# EAGLE design Relay_Board_2nd_Iteration (EAGLE 9.6.2)
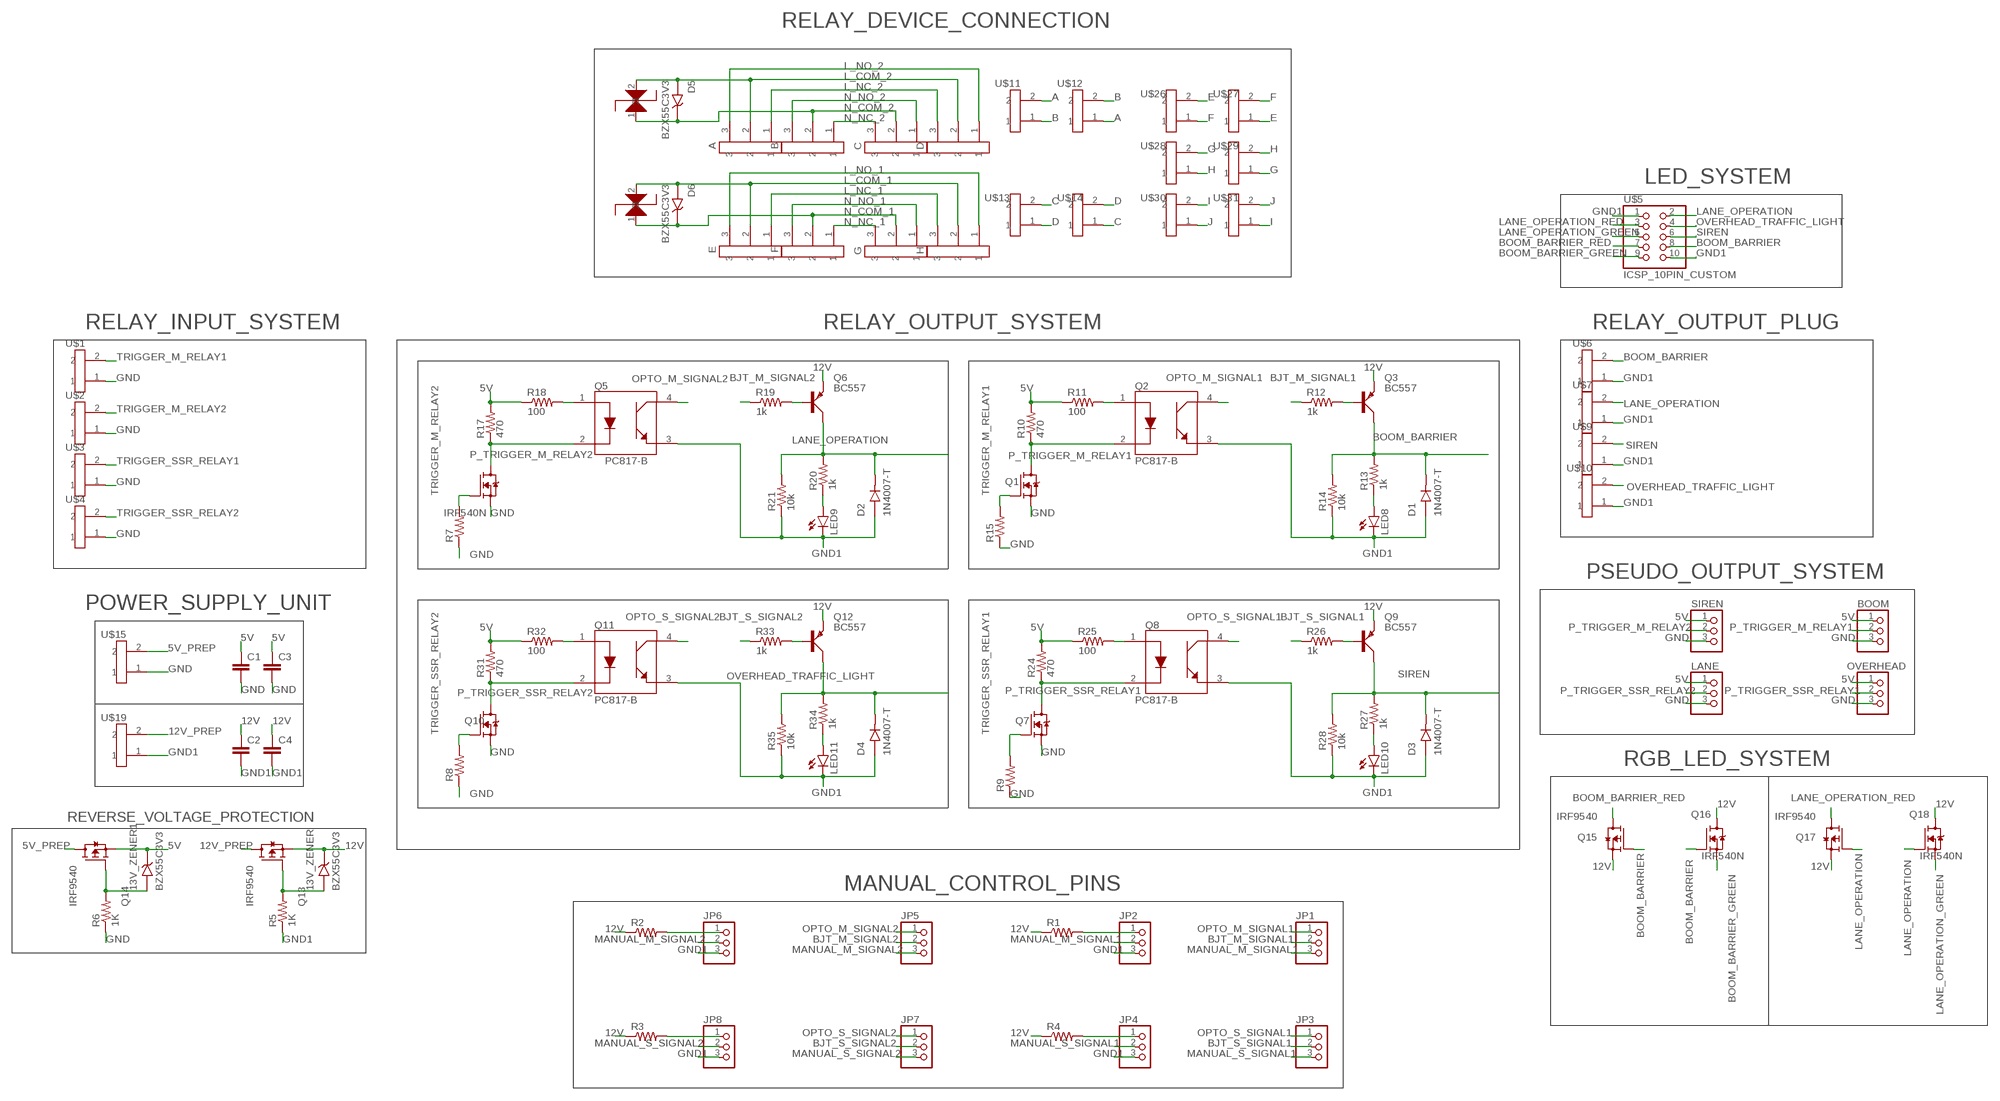
[diagram p0: schematic, sheet 1]

## Parts
13V_ZENER  BZX55C3V3  [DIOAD928W47L399D179]
13V_ZENER1  BZX55C3V3  [DIOAD928W47L399D179]
A  GREEN_PLUG_3  [GREEN_PLUG_3]
B  GREEN_PLUG_3  [GREEN_PLUG_3]
BOOM  PINHD-1X3  [1X03]
C  GREEN_PLUG_90_3  [GREEN_PLUG_90_3]
C1  CAPACITOR  [CAPACITOR]
C2  CAPACITOR  [CAPACITOR]
C3  CAPACITOR  [CAPACITOR]
C4  CAPACITOR  [CAPACITOR]
D  GREEN_PLUG_90_3  [GREEN_PLUG_90_3]
D1  1N4007-T  [DIOAD780W78L463D236]
D2  1N4007-T  [DIOAD780W78L463D236]
D3  1N4007-T  [DIOAD780W78L463D236]
D4  1N4007-T  [DIOAD780W78L463D236]
D5  BZX55C3V3  [DIOAD928W47L399D179]
D6  BZX55C3V3  [DIOAD928W47L399D179]
E  GREEN_PLUG_3  [GREEN_PLUG_3]
F  GREEN_PLUG_3  [GREEN_PLUG_3]
G  GREEN_PLUG_90_3  [GREEN_PLUG_90_3]
H  GREEN_PLUG_90_3  [GREEN_PLUG_90_3]
JP1  PINHD-1X3  [1X03]
JP2  PINHD-1X3  [1X03]
JP3  PINHD-1X3  [1X03]
JP4  PINHD-1X3  [1X03]
JP5  PINHD-1X3  [1X03]
JP6  PINHD-1X3  [1X03]
JP7  PINHD-1X3  [1X03]
JP8  PINHD-1X3  [1X03]
LANE  PINHD-1X3  [1X03]
LED8  LED  [LED]
LED9  LED  [LED]
LED10  LED  [LED]
LED11  LED  [LED]
OVERHEAD  PINHD-1X3  [1X03]
Q1  IRF540N  [TO254P1054X469X1930-3]
Q2  PC817-B  [DIP762W50P254L650H455Q4B]
Q3  BC557  [SOT54A]
Q4  IRF540N  [TO254P1054X469X1930-3]
Q5  PC817-B  [DIP762W50P254L650H455Q4B]
Q6  BC557  [SOT54A]
Q7  IRF540N  [TO254P1054X469X1930-3]
Q8  PC817-B  [DIP762W50P254L650H455Q4B]
Q9  BC557  [SOT54A]
Q10  IRF540N  [TO254P1054X469X1930-3]
Q11  PC817-B  [DIP762W50P254L650H455Q4B]
Q12  BC557  [SOT54A]
Q13  IRF9540  [TO254P1052X465X1989-3]
Q14  IRF9540  [TO254P1052X465X1989-3]
Q15  IRF9540  [TO254P1052X465X1989-3]
Q16  IRF540N  [TO254P1054X469X1930-3]
Q17  IRF9540  [TO254P1052X465X1989-3]
Q18  IRF540N  [TO254P1054X469X1930-3]
R1  RESISTOR  [RESISTOR]
R2  RESISTOR  [RESISTOR]
R3  RESISTOR  [RESISTOR]
R4  RESISTOR  [RESISTOR]
R5  1K  RESISTOR  [RESISTOR]
R6  1K  RESISTOR  [RESISTOR]
R7  RESISTOR  [RESISTOR]
R8  RESISTOR  [RESISTOR]
R9  RESISTOR  [RESISTOR]
R10  470  RESISTOR  [RESISTOR]
R11  100  RESISTOR  [RESISTOR]
R12  1k  RESISTOR  [RESISTOR]
R13  1k  RESISTOR  [RESISTOR]
R14  10k  RESISTOR  [RESISTOR]
R15  RESISTOR  [RESISTOR]
R17  470  RESISTOR  [RESISTOR]
R18  100  RESISTOR  [RESISTOR]
R19  1k  RESISTOR  [RESISTOR]
R20  1k  RESISTOR  [RESISTOR]
R21  10k  RESISTOR  [RESISTOR]
R24  470  RESISTOR  [RESISTOR]
R25  100  RESISTOR  [RESISTOR]
R26  1k  RESISTOR  [RESISTOR]
R27  1k  RESISTOR  [RESISTOR]
R28  10k  RESISTOR  [RESISTOR]
R31  470  RESISTOR  [RESISTOR]
R32  100  RESISTOR  [RESISTOR]
R33  1k  RESISTOR  [RESISTOR]
R34  1k  RESISTOR  [RESISTOR]
R35  10k  RESISTOR  [RESISTOR]
SIREN  PINHD-1X3  [1X03]
U$1  GREEN_PLUG_90_2  [GREEN_PLUG_90_2]
U$2  GREEN_PLUG_90_2  [GREEN_PLUG_90_2]
U$3  GREEN_PLUG_90_2  [GREEN_PLUG_90_2]
U$4  GREEN_PLUG_90_2  [GREEN_PLUG_90_2]
U$5  ICSP_10PIN_CUSTOM  [ICSP_10PIN_CUSTOM]
U$6  GREEN_PLUG_2  [GREEN_PLUG_2]
U$7  GREEN_PLUG_2  [GREEN_PLUG_2]
U$9  GREEN_PLUG_2  [GREEN_PLUG_2]
U$10  GREEN_PLUG_2  [GREEN_PLUG_2]
U$11  GREEN_PLUG_2  [GREEN_PLUG_2]
U$12  GREEN_PLUG_90_2  [GREEN_PLUG_90_2]
U$13  GREEN_PLUG_90_2  [GREEN_PLUG_90_2]
U$14  GREEN_PLUG_2  [GREEN_PLUG_2]
U$15  GREEN_PLUG_90_2  [GREEN_PLUG_90_2]
U$19  GREEN_PLUG_90_2  [GREEN_PLUG_90_2]
U$24  1KE100A_CUSTOM  [1KE100A_CUSTOM]
U$25  1KE100A_CUSTOM  [1KE100A_CUSTOM]
U$26  GREEN_PLUG_2  [GREEN_PLUG_2]
U$27  GREEN_PLUG_90_2  [GREEN_PLUG_90_2]
U$28  GREEN_PLUG_2  [GREEN_PLUG_2]
U$29  GREEN_PLUG_90_2  [GREEN_PLUG_90_2]
U$30  GREEN_PLUG_2  [GREEN_PLUG_2]
U$31  GREEN_PLUG_90_2  [GREEN_PLUG_90_2]

## Nets
5V: 13V_ZENER1.C(K) BOOM.1 C1.1 C3.1 LANE.1 OVERHEAD.1 Q14.3(S) R10.2 R11.1 R17.2 R18.1 R24.2 R25.1 R31.2 R32.1 SIREN.1
5V_PREP: Q14.2(D) U$15.2
12V: 13V_ZENER.C(K) C2.1 C4.1 Q3.E Q6.E Q9.E Q12.E Q13.3(S) Q15.3(S) Q16.2(D) Q17.3(S) Q18.2(D) R1.1 R2.1 R3.1 R4.1
12V_PREP: Q13.2(D) U$19.2
A: U$11.2 U$12.1
B: U$11.1 U$12.2
BJT_M_SIGNAL1: JP1.2 R12.1
BJT_M_SIGNAL2: JP5.2 R19.1
BJT_S_SIGNAL1: JP3.2 R26.1
BJT_S_SIGNAL2: JP7.2 R33.1
BOOM_BARRIER: D1.K Q3.C Q15.1(G) Q16.1(G) R13.2 R14.2 U$5.8 U$6.2
BOOM_BARRIER_GREEN: Q16.3(S) U$5.9
BOOM_BARRIER_RED: Q15.2(D) U$5.7
C: U$13.2 U$14.1
D: U$13.1 U$14.2
E: U$26.2 U$27.1
F: U$26.1 U$27.2
G: U$28.2 U$29.1
GND: BOOM.3 C1.2 C3.2 LANE.3 OVERHEAD.3 Q1.3(S) Q4.3(S) Q7.3(S) Q10.3(S) R6.1 R7.1 R8.1 R9.1 R15.1 SIREN.3 U$1.1 U$2.1 U$3.1 U$4.1 U$15.1
GND1: C2.2 C4.2 D1.A D2.A D3.A D4.A JP2.3 JP4.3 JP6.3 JP8.3 LED8.K(C) LED9.K(C) LED10.K(C) LED11.K(C) Q2.3(EMITTER) Q5.3(EMITTER) Q8.3(EMITTER) Q11.3(EMITTER) R5.1 R14.1 R21.1 R28.1 R35.1 U$5.1 U$5.10 U$6.1 U$7.1 U$9.1 U$10.1 U$19.1
H: U$28.1 U$29.2
I: U$30.2 U$31.1
J: U$30.1 U$31.2
L_COM_1: D6.A E.2 H.2 U$25.2
L_COM_2: A.2 D5.A D.2 U$24.2
L_NC_1: E.1 H.3
L_NC_2: A.1 D.3
L_NO_1: E.3 H.1
L_NO_2: A.3 D.1
LANE_OPERATION: D2.K Q6.C Q17.1(G) Q18.1(G) R20.2 R21.2 U$5.2 U$7.2
LANE_OPERATION_GREEN: Q18.3(S) U$5.5
LANE_OPERATION_RED: Q17.2(D) U$5.3
MANUAL_M_SIGNAL1: JP1.3 JP2.2
MANUAL_M_SIGNAL2: JP5.3 JP6.2
MANUAL_S_SIGNAL1: JP3.3 JP4.2
MANUAL_S_SIGNAL2: JP7.3 JP8.2
N$1: 13V_ZENER1.A Q14.1(G) R6.2
N$2: Q3.B R12.2
N$3: 13V_ZENER.A Q13.1(G) R5.2
N$8: JP2.1 R1.2
N$11: JP4.1 R4.2
N$12: LED8.A R13.1
N$14: Q2.1(ANODE) R11.2
N$16: Q6.B R19.2
N$18: LED9.A R20.1
N$19: Q5.1(ANODE) R18.2
N$23: Q9.B R26.2
N$25: LED10.A R27.1
N$26: Q8.1(ANODE) R25.2
N$28: JP6.1 R2.2
N$30: Q12.B R33.2
N$32: LED11.A R34.1
N$33: Q11.1(ANODE) R32.2
N$34: JP8.1 R3.2
N_COM_1: D6.C(K) F.2 G.2 U$25.1
N_COM_2: B.2 C.2 D5.C(K) U$24.1
N_NC_1: F.1 G.3
N_NC_2: B.1 C.3
N_NO_1: F.3 G.1
N_NO_2: B.3 C.1
OPTO_M_SIGNAL1: JP1.1 Q2.4(COLLECTOR)
OPTO_M_SIGNAL2: JP5.1 Q5.4(COLLECTOR)
OPTO_S_SIGNAL1: JP3.1 Q8.4(COLLECTOR)
OPTO_S_SIGNAL2: JP7.1 Q11.4(COLLECTOR)
OVERHEAD_TRAFFIC_LIGHT: D4.K Q12.C R34.2 R35.2 U$5.4 U$10.2
P_TRIGGER_M_RELAY1: BOOM.2 Q1.2(D) Q2.2(CATHODE) R10.1
P_TRIGGER_M_RELAY2: Q4.2(D) Q5.2(CATHODE) R17.1 SIREN.2
P_TRIGGER_SSR_RELAY1: OVERHEAD.2 Q7.2(D) Q8.2(CATHODE) R24.1
P_TRIGGER_SSR_RELAY2: LANE.2 Q10.2(D) Q11.2(CATHODE) R31.1
SIREN: D3.K Q9.C R27.2 R28.2 U$5.6 U$9.2
TRIGGER_M_RELAY1: Q1.1(G) R15.2 U$1.2
TRIGGER_M_RELAY2: Q4.1(G) R7.2 U$2.2
TRIGGER_SSR_RELAY1: Q7.1(G) R9.2 U$3.2
TRIGGER_SSR_RELAY2: Q10.1(G) R8.2 U$4.2

## Notes on the sheet
- RELAY_DEVICE_CONNECTION
- LED_SYSTEM
- RELAY_INPUT_SYSTEM | RELAY_OUTPUT_SYSTEM | RELAY_OUTPUT_PLUG
- PSEUDO_OUTPUT_SYSTEM
- POWER_SUPPLY_UNIT
- RGB_LED_SYSTEM
- REVERSE_VOLTAGE_PROTECTION
- MANUAL_CONTROL_PINS

## Library data of the parts
13V_ZENER 13V_ZENER1 D5 D6 = BZX55C3V3:BZX55C3V3: Check availability <https://pricing.snapeda.com/parts/BZX55C3V3-TR/Vishay%20Semiconductor/view-part?ref=eda>; AVAILABILITY: In Stock; CHECK_PRICES: https://www.snapeda.com/parts/BZX55C3V3-TR/Vishay/view-part/?ref=eda; DESCRIPTION: Zener Diode 3.3 V 500 mW ±6% Through Hole DO-204AH (DO-35); MF: Vishay Semiconductor; MP: BZX55C3V3-TR; PACKAGE: DO-35 NXP Semiconductors; PRICE: None; SNAPEDA_LINK: https://www.snapeda.com/parts/BZX55C3V3-TR/Vishay/view-part/?ref=snap
A B E F = Green_plug_90:GREEN_PLUG_3
BOOM JP1-JP8 LANE OVERHEAD SIREN = pinhead:PINHD-1X3: PIN HEADER
C D G H = Green_plug_90:GREEN_PLUG_90_3
C1-C4 = Hand_Solder:CAPACITOR: Hand Solder Capacitor
D1-D4 = 1N4007-T:1N4007-T: Check availability <https://pricing.snapeda.com/parts/1N4007-T/Diodes%20Incorporated/view-part?ref=eda>; AVAILABILITY: In Stock; CHECK_PRICES: https://www.snapeda.com/parts/1N4007-T/Diodes+Inc./view-part/?ref=eda; DESCRIPTION: Diode Standard 1A 1000V 1Vf DO41 | Diodes Inc 1N4007-T; MF: Diodes Incorporated; MP: 1N4007-T; PACKAGE: DO-41 Diodes Inc.; PRICE: None; SNAPEDA_LINK: https://www.snapeda.com/parts/1N4007-T/Diodes+Inc./view-part/?ref=snap
LED8-LED11 = Hand_Solder:LED: LED HAND SOLDER
Q1 Q4 Q7 Q10 Q16 Q18 = IRF540N:IRF540N: Check availability <https://pricing.snapeda.com/parts/IRF540N/Infineon%20Technologies/view-part?ref=eda>; AVAILABILITY: In Stock; CHECK_PRICES: https://www.snapeda.com/parts/IRF540N/Infineon/view-part/?ref=eda; DESCRIPTION: Transistor NPN MOS IRF540/IRF540N INTERNATIONAL RECTIFIER Ampere=28 V=100 TO220; MF: Infineon Technologies; MP: IRF540N; PACKAGE: Package; PRICE: None; SNAPEDA_LINK: https://www.snapeda.com/parts/IRF540N/Infineon/view-part/?ref=snap
Q2 Q5 Q8 Q11 = PC817-B:PC817-B: Check availability <https://pricing.snapeda.com/parts/PC817-B/American%20Bright/view-part?ref=eda>; AVAILABILITY: Not in stock; CHECK_PRICES: https://www.snapeda.com/parts/PC817-B/American+Bright/view-part/?ref=eda; DESCRIPTION: Phototransistors 4-DIP (0.300, 7.62mm); MF: American Bright; MP: PC817-B; PACKAGE: DIP-4 American Bright; PRICE: None; SNAPEDA_LINK: https://www.snapeda.com/parts/PC817-B/American+Bright/view-part/?ref=snap
Q3 Q6 Q9 Q12 = BC557:BC557: Check availability <https://pricing.snapeda.com/parts/BC557/ON%20Semiconductor/view-part?ref=eda>; AVAILABILITY: Not in stock; CHECK_PRICES: https://www.snapeda.com/parts/BC557/Onsemi/view-part/?ref=eda; DESCRIPTION: Bipolar (BJT) Transistor PNP 45 V 100 mA 320MHz 625 mW Through Hole TO-92 (TO-226); MF: ON Semiconductor; MP: BC557; PACKAGE: E-PKG AXIAL-LEADED-2 ON Semiconductor; PRICE: None; SNAPEDA_LINK: https://www.snapeda.com/parts/BC557/Onsemi/view-part/?ref=snap
Q13-Q15 Q17 = IRF9540:IRF9540: Trans MOSFET P-CH 100V 6.8A 3-Pin(3+Tab) TO-220AB Check availability <https://pricing.snapeda.com/parts/IRF9540/Vishay%20Siliconix/view-part?ref=eda>; AVAILABILITY: In Stock; CHECK_PRICES: https://www.snapeda.com/parts/IRF9540/Vishay/view-part/?ref=eda; DESCRIPTION: P-Channel 100 V 19A (Tc) 3.7W (Ta), 150W (Tc) Surface Mount D²PAK (TO-263); MF: Vishay Siliconix; MP: IRF9540; PACKAGE: TO-220-3 Vishay; PRICE: None; SNAPEDA_LINK: https://www.snapeda.com/parts/IRF9540/Vishay/view-part/?ref=snap
R1-R15 R17-R21 R24-R28 R31-R35 = Hand_Solder:RESISTOR: Hand Solder Resistor
U$1-U$4 U$12 U$13 U$15 U$19 U$27 U$29 U$31 = Green_plug_90:GREEN_PLUG_90_2
U$5 = ISCP_10PIN_CUSTOM:ICSP_10PIN_CUSTOM
U$6 U$7 U$9-U$11 U$14 U$26 U$28 U$30 = Green_plug_90:GREEN_PLUG_2
U$24 U$25 = 1KE100A_CUSTOM:1KE100A_CUSTOM

## Board
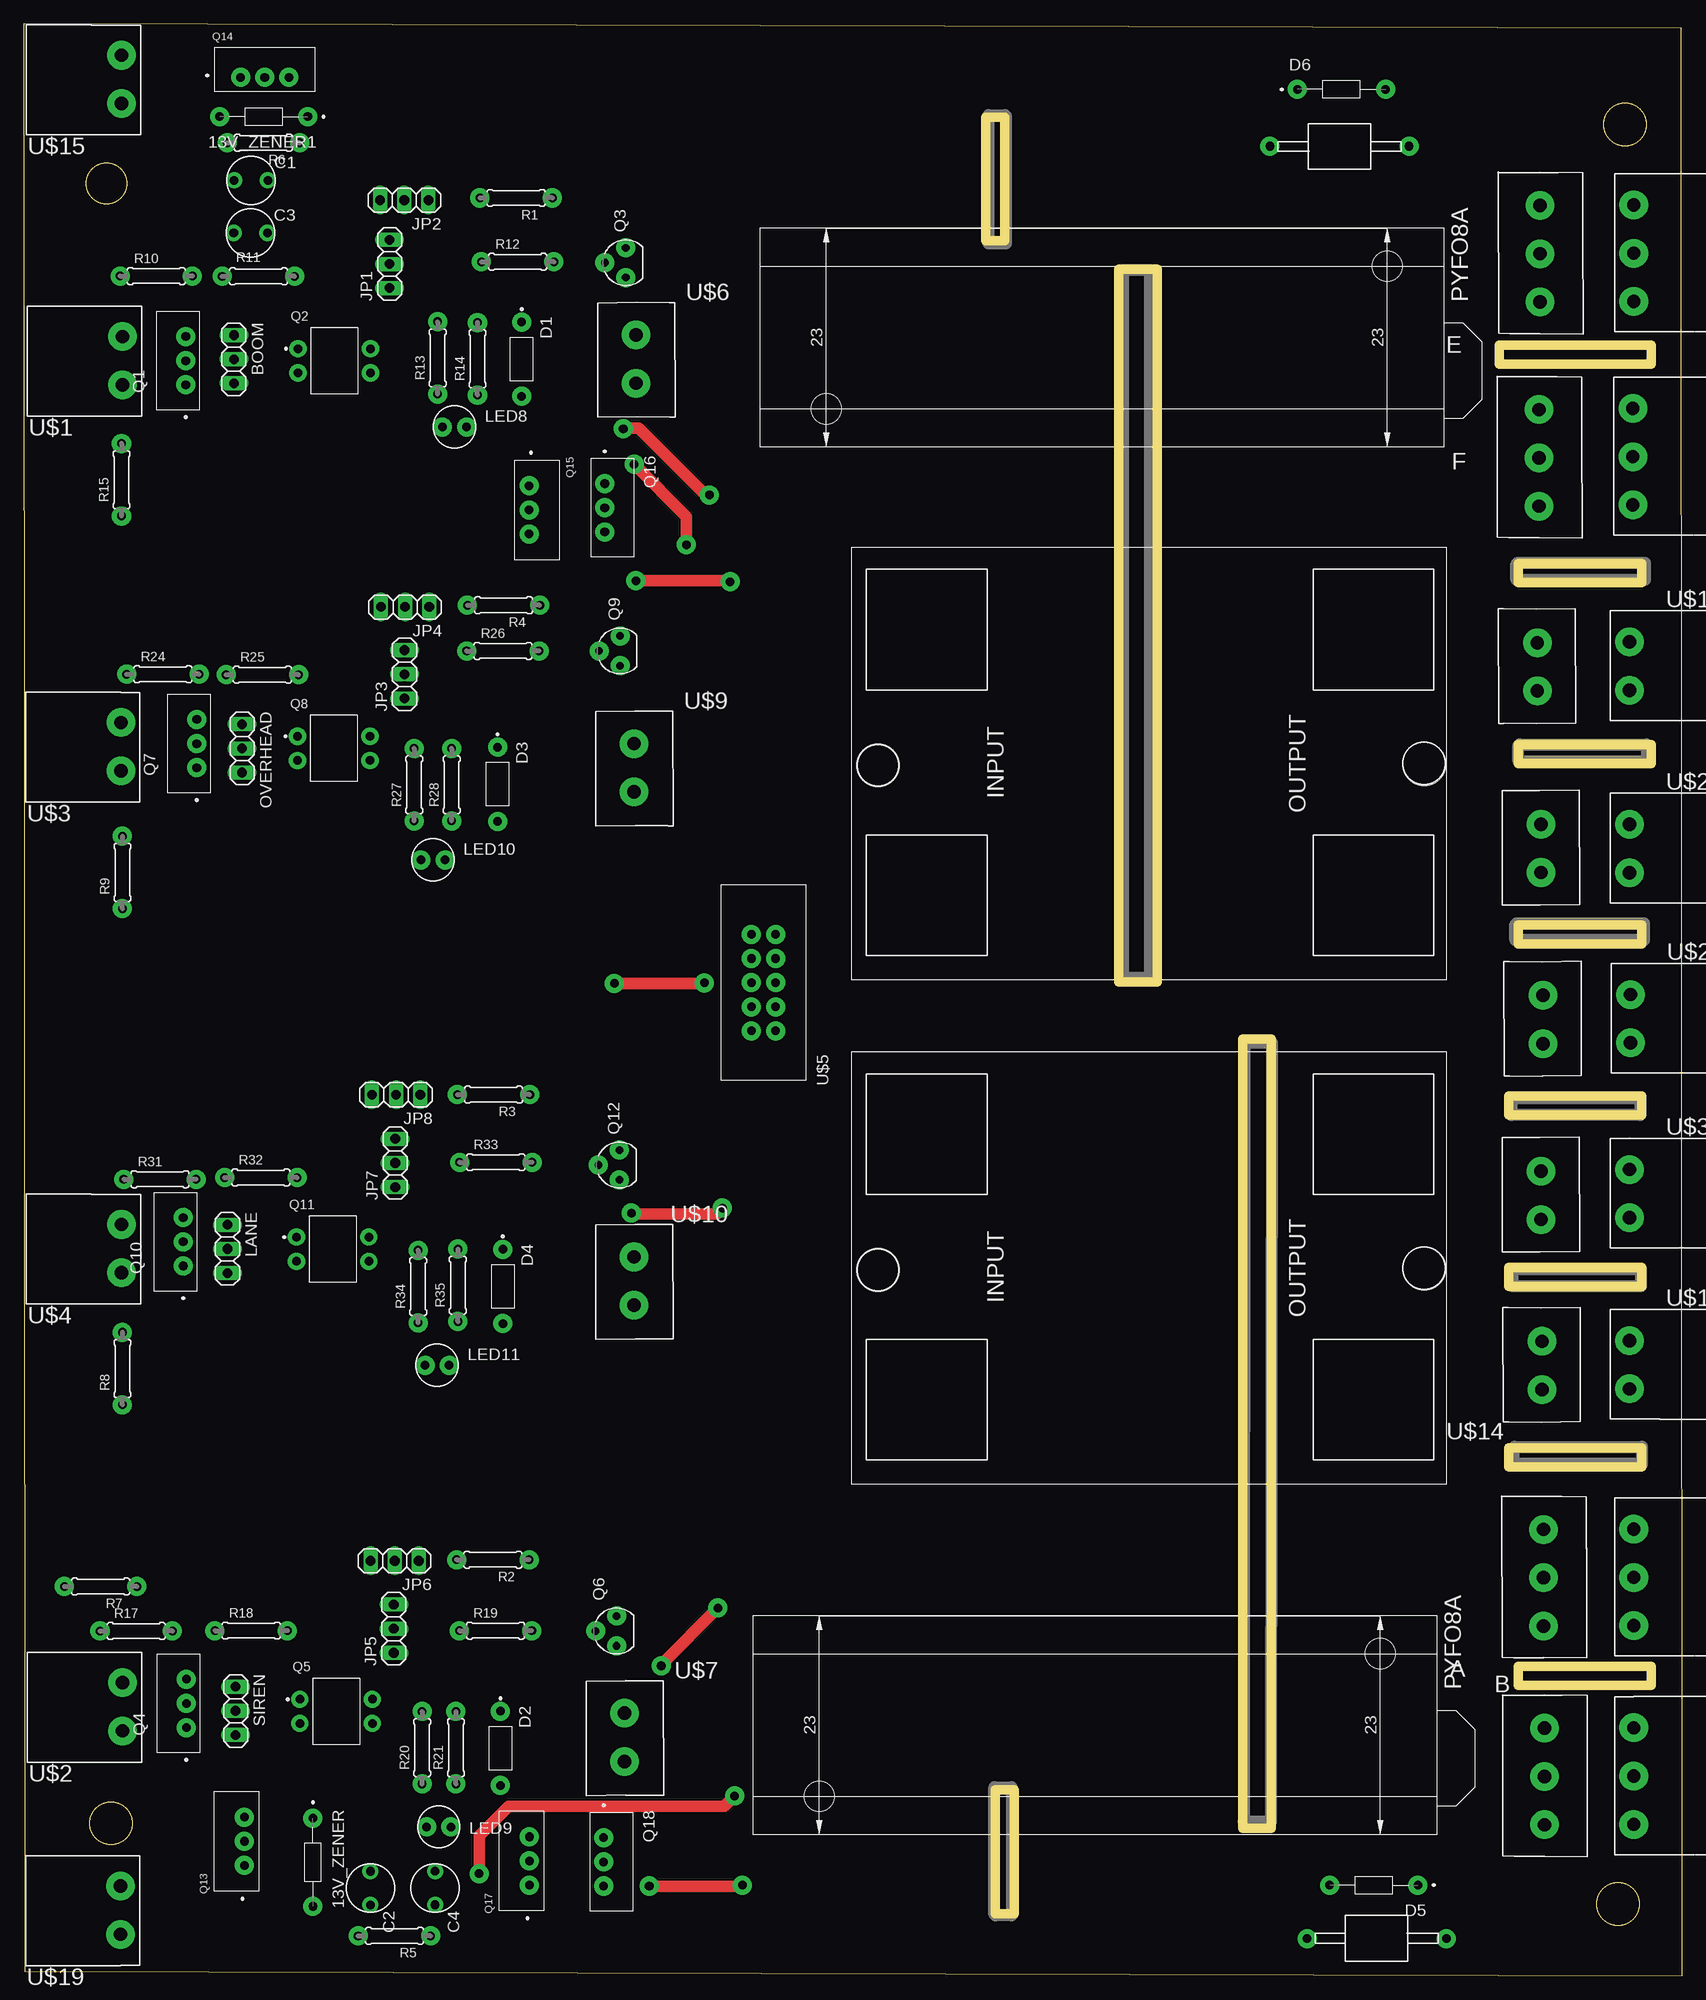
[diagram p1: board, top side]
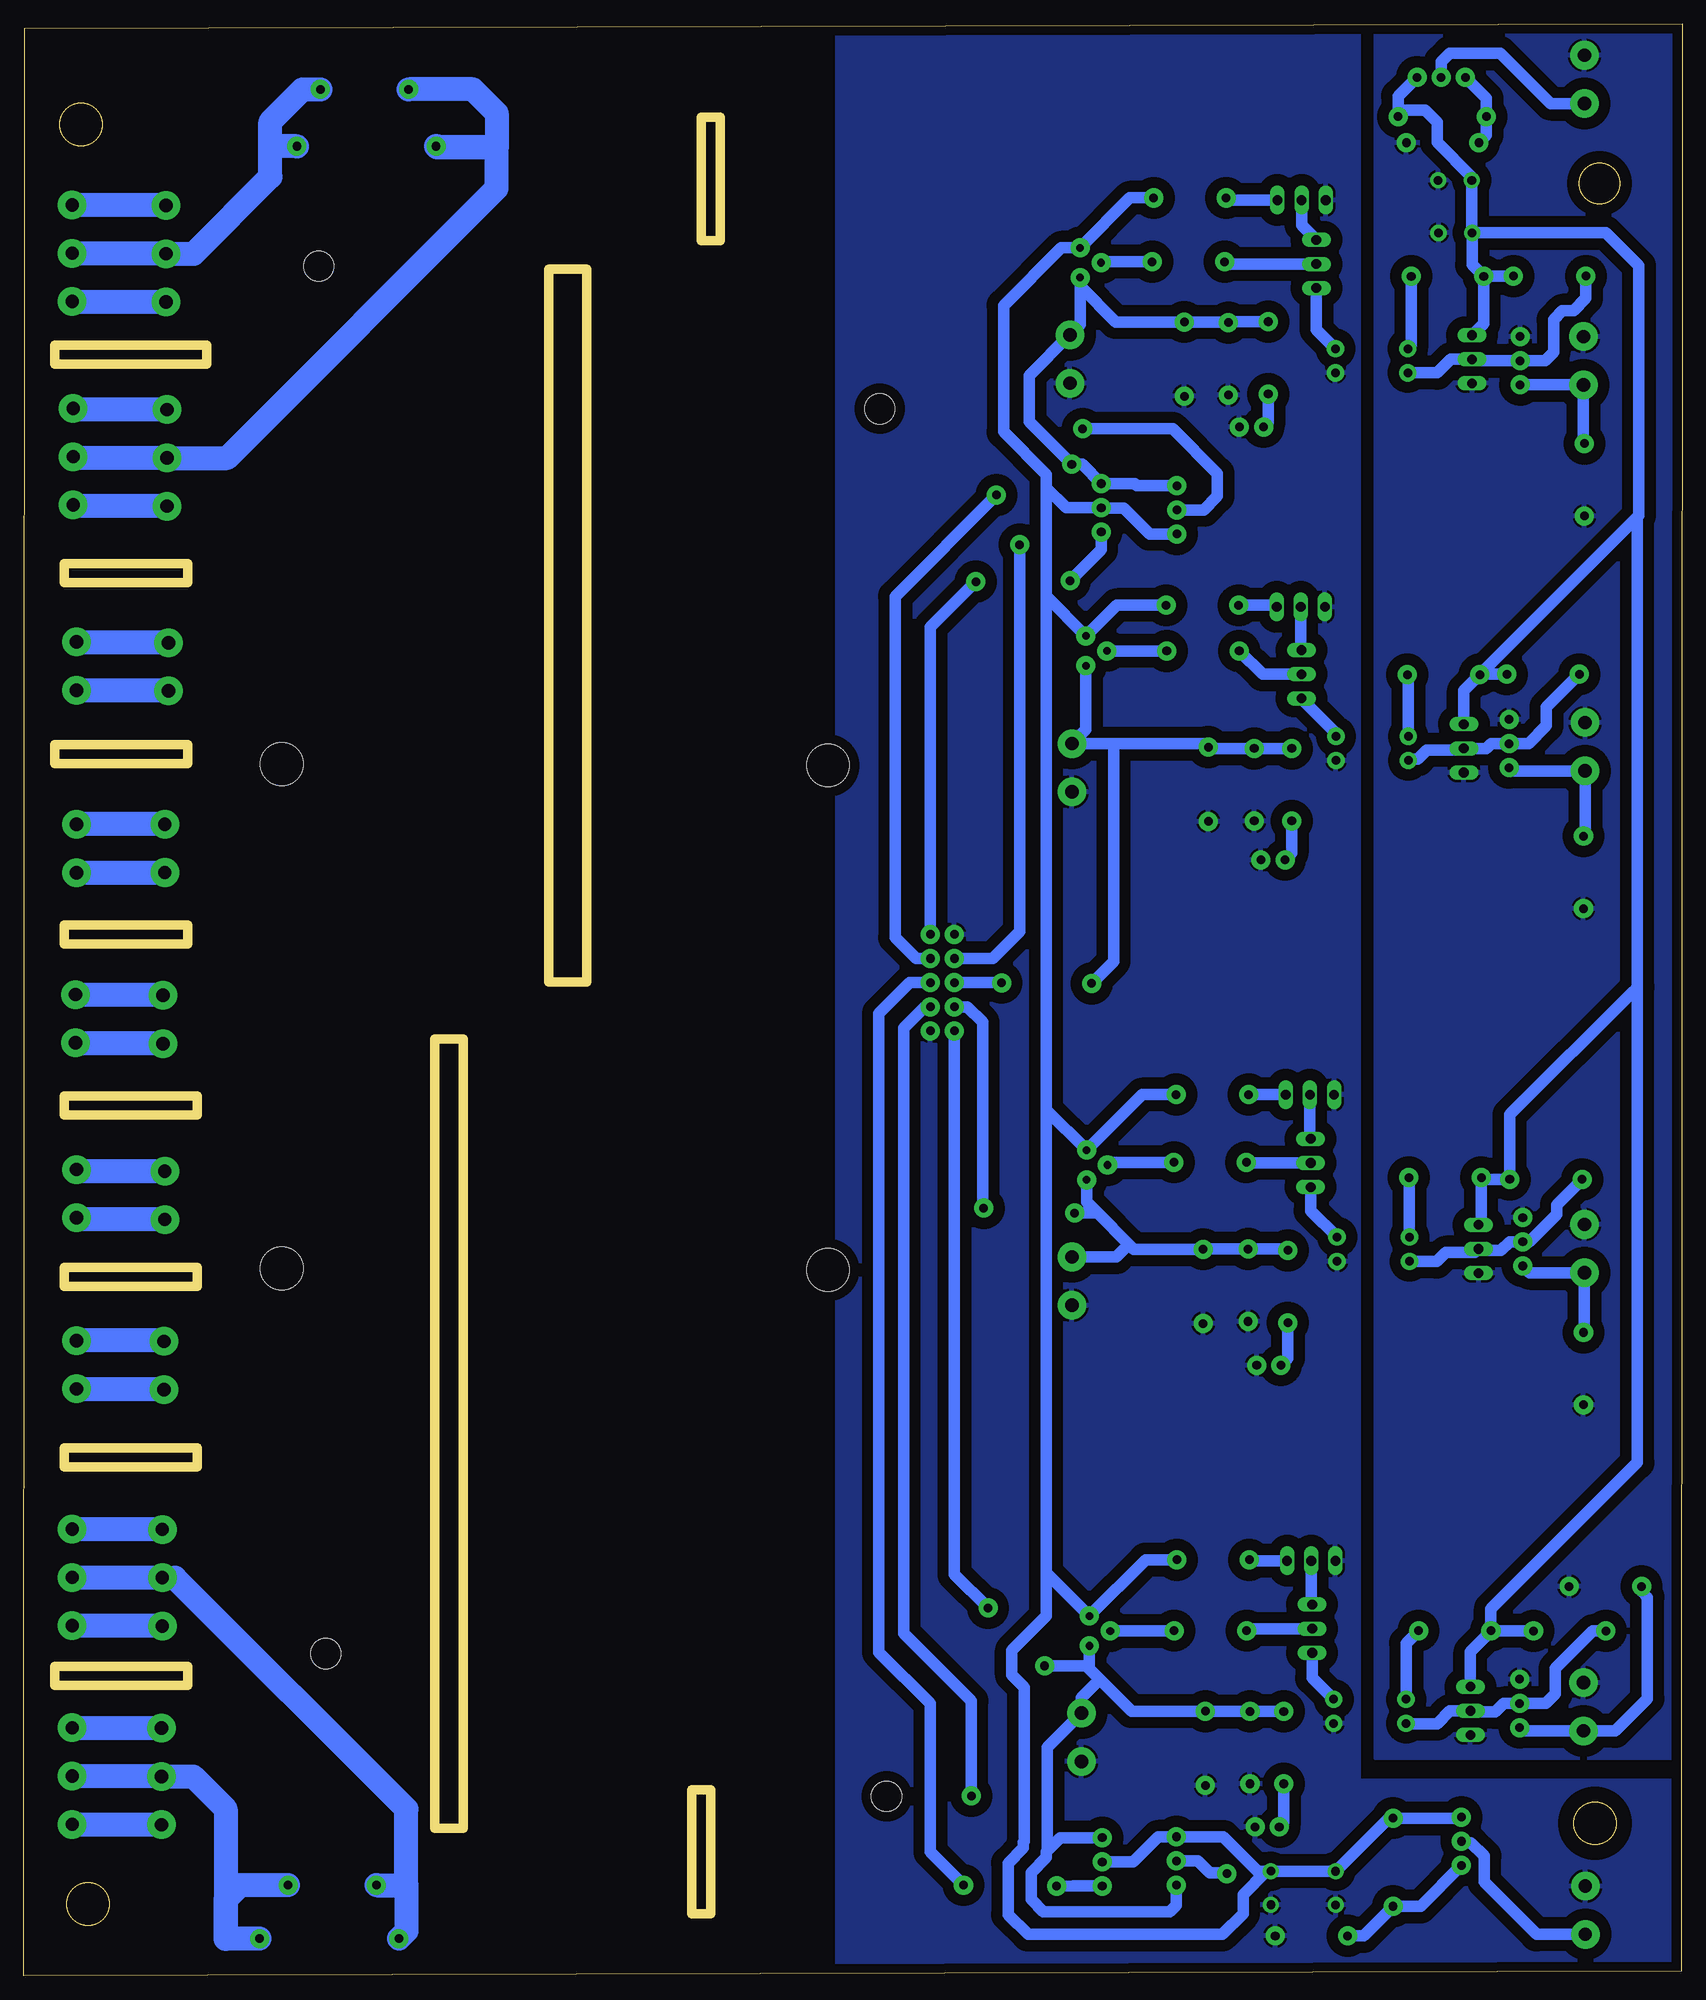
[diagram p2: board, bottom side, seen from below]

Size 174.42 x 205.35 mm. Coordinates in mm from the lower left corner, seen from the top.
Outline: 0.09,0.47 174.42,0 174.33,204.88 0,205.35 0.09,0.47
Outline: 115.19,179.54 115.19,104.54 119.19,104.54 119.19,179.54 115.19,179.54
Outline: 128.19,98.54 128.19,15.54 131.19,15.54 131.19,98.54 128.19,98.54
Outline: 170.19,148.54 157.19,148.54 157.19,146.54 170.19,146.54 170.19,148.54
Outline: 157.19,129.54 171.19,129.54 171.19,127.54 157.19,127.54 157.19,129.54
Outline: 157.19,110.54 170.19,110.54 170.19,108.54 157.19,108.54 157.19,110.54
Outline: 156.19,92.54 170.19,92.54 170.19,90.54 156.19,90.54 156.19,92.54
Outline: 156.19,74.54 170.19,74.54 170.19,72.54 156.19,72.54 156.19,74.54
Outline: 156.19,55.54 170.19,55.54 170.19,53.54 156.19,53.54 156.19,55.54
Outline: 157.19,32.54 171.19,32.54 171.19,30.54 157.19,30.54 157.19,32.54
Outline: 155.19,171.54 171.19,171.54 171.19,169.54 155.19,169.54 155.19,171.54
Outline: 103.19,182.54 103.19,195.54 101.19,195.54 101.19,182.54 103.19,182.54
Outline: 102.19,19.54 102.19,6.54 104.19,6.54 104.19,19.54 102.19,19.54
Outline: circle at 8.69,188.54 radius 2.12
Outline: circle at 9.19,16.04 radius 2.24
Outline: circle at 167.69,7.54 radius 2.24
Outline: circle at 168.39,194.74 radius 2.24
Copper layers (1*16): Top 0.035mm / dielectric 1.5mm / Bottom 0.035mm
Design rules "default *": minimum track width 1.2mm, minimum drill 0.35mm, track to track 1.2mm, track to pad 0.5mm, pad to pad 0.5mm, via to via 0.8mm, smd to smd 6mil, copper to edge 40mil, drill to drill 6mil, minimum pad ring 10mil, minimum via ring 8mil, stop-mask expansion 4mil, vias tented up to drill 0mil, thermal gap 10mil
tRestrict: area 163.9,3.7 to 171.5,11.3; area 5.4,12.3 to 13,19.9; area 4.9,184.8 to 12.5,192.4; area 164.6,190.8 to 172.2,198.5
bRestrict: area 5.4,12.2 to 13,19.8; area 5.3,185.2 to 12,191.9; area 163.9,3.7 to 171.5,11.3; area 164.6,190.9 to 172.2,198.5

### Footprints (pad centres in the part's own frame; a part is rotated, then mirrored left to right if it is on the bottom)
DIOAD928W47L399D179 = drill 0.9 pad 2: A 4.64,0; C -4.64,0
GREEN_PLUG_3 = drill 1.4 pad 3: 1 -0.041,5.012; 2 -0.041,-0.068; 3 -0.041,-5.148
1X03 = drill 1.016 long: 1 -2.54,0; 2 0,0; 3 2.54,0
GREEN_PLUG_90_3 = drill 1.4 pad 3: 1 -0.041,5.012; 2 -0.041,-0.068; 3 -0.041,-5.148
CAPACITOR = drill 0.9 pad 1.7: 1 -1.77,0; 2 1.77,0
DIOAD780W78L463D236 = drill 0.9 pad 2: A 3.905,0; K -3.905,0
LED = drill 0.9 pad 2: A -1.292,-0.049; K 1.248,-0.049
TO254P1054X469X1930-3 = drill 0.9 pad 2: 1 -2.54,-0.81; 2 0,-0.81; 3 2.54,-0.81
DIP762W50P254L650H455Q4B = drill 0.9 pad 1.8: 1 -3.81,1.27; 2 -3.81,-1.27; 3 3.81,-1.27; 4 3.81,1.27
SOT54A = drill 0.8 pad 2: B 0,2.205; C -1.57,0; E 1.57,0
TO254P1052X465X1989-3 = drill 0.9 pad 2: 1 0,0; 2 2.54,0; 3 5.08,0
RESISTOR = drill 0.9 pad 2: 1 -3.777,0.007; 2 3.843,0.007
GREEN_PLUG_90_2 = drill 1.4 pad 3: 1 0,0; 2 0,-5.08
ICSP_10PIN_CUSTOM = drill 0.9 pad 2: 1 -5.08,-1.27; 2 -5.08,1.27; 3 -2.54,-1.27; 4 -2.54,1.27; 5 0,-1.27; 6 0,1.27; 7 2.54,-1.27; 8 2.54,1.27; 9 5.08,-1.27; 10 5.08,1.27
GREEN_PLUG_2 = drill 1.4 pad 3: 1 0,0; 2 0,-5.08
PYF08A-E = hole 3.2: 4,65; 19,6
SSR-40DASOLIDSTATERELAYMODULE = hole 4.5: 59.75,-22.55; 2.3,-22.7
1KE100A_CUSTOM = drill 0.9 pad 2: 1 0.027,7.334; 2 0.027,-7.321

### Placement (x,y rotation side)
13V_ZENER  30.41,11.95 270 top
13V_ZENER1  25.23,195.58 180 top
A  159.89,41.94 0 top
B  159.97,21.04 0 top
BOOM  22.1,170.05 270 top
C  169.29,20.94 180 top
C1  23.9,188.88 0 top
C2  36.45,9.22 270 top
C3  23.85,183.35 0 top
C4  43.27,9.23 270 top
D  169.29,41.84 180 top
D1  52.36,170.07 270 top
D2  50.14,23.93 270 top
D3  49.83,125.35 270 top
D4  50.38,72.52 270 top
D5  141.99,9.54 180 top
D6  138.59,198.44 0 top
E  159.51,181.22 0 top
F  159.4,159.75 0 top
G  169.19,159.74 180 top
H  169.29,181.14 180 top
JP1  38.48,180.08 90 top
JP2  40.02,186.79 180 top
JP3  40.05,136.91 90 top
JP4  40.11,143.99 180 top
JP5  38.91,36.51 90 top
JP6  39.01,43.65 180 top
JP7  39.07,85.5 90 top
JP8  39.15,92.68 180 top
LANE  21.42,76.46 270 top
LED8  45.32,162.98 0 top
LED9  43.67,15.71 0 top
LED10  43.06,117.44 0 top
LED11  43.5,64.28 0 top
OVERHEAD  22.97,129.11 270 top
Q1  16.23,169.9 90 top
Q2  32.65,169.89 0 top
Q3  63.32,180.21 90 top
Q4  16.28,28.65 90 top
Q5  32.85,27.81 0 top
Q6  62.35,36.27 90 top
Q7  17.38,129.62 90 top
Q8  32.6,129.11 0 top
Q9  62.71,139.37 90 top
Q10  15.96,77.21 90 top
Q11  32.49,76.43 0 top
Q12  62.65,85.29 90 top
Q13  23.21,11.6 90 top
Q14  22.81,199.71 0 top
Q15  53.15,156.74 270 top
Q16  61.91,154.43 270 top
Q17  53.19,9.54 90 top
Q18  61.8,11.98 270 top
R1  51.81,187.03 180 top
R2  49.37,43.77 180 top
R3  49.44,92.7 180 top
R4  50.49,144.18 180 top
R5  39.02,4.21 180 top
R6  25.23,192.84 180 top
R7  8.12,40.95 180 top
R8  10.39,63.84 90 top
R9  10.39,116.04 90 top
R10  13.9,178.79 0 top
R11  24.65,178.77 0 top
R12  51.9,180.3 0 top
R13  43.54,170.16 90 top
R14  47.73,170.07 90 top
R15  10.29,157.34 90 top
R17  11.79,36.27 0 top
R18  23.88,36.3 0 top
R19  49.58,36.29 0 top
R20  41.91,23.97 90 top
R21  45.46,23.97 90 top
R24  14.6,136.91 0 top
R25  25.06,136.87 0 top
R26  50.36,139.36 0 top
R27  41.07,125.26 90 top
R28  45.01,125.26 90 top
R31  14.29,83.78 0 top
R32  24.9,83.97 0 top
R33  49.61,85.57 0 top
R34  41.49,72.48 90 top
R35  45.65,72.61 90 top
SIREN  22.28,27.86 270 top
U$1  10.39,172.44 0 top
U$2  10.39,30.84 0 top
U$3  10.21,131.84 0 top
U$4  10.29,79.04 0 top
U$5  77.81,104.47 90 top
U$6  64.39,167.54 180 top
U$7  63.19,22.54 180 top
U$8  [PYF08A-E]  149.4,160.85 90 top
U$9  64.19,124.54 180 top
U$10  64.19,70.54 180 top
U$11  159.19,140.24 0 top
U$12  168.89,135.24 180 top
U$13  168.89,61.74 180 top
U$14  159.69,66.74 0 top
U$15  10.29,202.04 0 top
U$16  [PYF08A-E]  148.67,14.88 90 top
U$17  [SSR-40DASOLIDSTATERELAYMODULE]  149.59,104.78 180 top
U$18  [SSR-40DASOLIDSTATERELAYMODULE]  149.59,51.71 180 top
U$19  10.19,9.44 0 top
U$24  142.29,3.94 270 top
U$25  138.39,192.44 90 top
U$26  159.59,121.14 0 top
U$27  168.89,116.04 180 top
U$28  159.79,103.14 0 top
U$29  168.99,98.14 180 top
U$30  159.59,84.64 0 top
U$31  168.89,79.74 180 top

### Tracks (layer width: path | path; a pad name or v marks a point on that pad's centre or on a via)
5V
  Bottom 1.2: R17.2 20.08,36.27 | 20.08,36.27 R18.1 20.11,38.61 4.72,54 4.72,104 | SIREN.1 22.28,34.07 20.08,36.27 | Q14.3 29.87,197.73 13V_ZENER1.C 29.2,196.25 27.03,196.25 25.78,195 25.78,192.87 22.13,189.22 C1.1 22.13,183.39 C3.1 | C3.1 8.01,183.35 4.55,179.89 4.55,153.61 4.71,153.46 | LANE.1 21.12,79.3 R32.1 20.93,83.79 R31.2 18.14,90.59 5.17,103.55 4.72,104 | R24.2 21.25,136.91 R25.1 | OVERHEAD.1 22.97,135.19 R25.1 | 4.71,153.46 4.71,104.02 4.72,104 | R25.1 4.71,153.46 | BOOM.1 20.87,173.82 R11.1 | R11.1 20.85,178.8 R10.2 | C3.1 22.08,179.99 R11.1
5V_PREP
  Bottom 1.2: Q14.2 25.35,201.38 24.46,202.26 19.15,202.26 13.84,196.96 U$15.2
12V
  Bottom 1.2: R1.1 58.08,187.02 Q3.E 65.3,181.78 71.38,175.7 71.38,162.42 66.88,157.92 66.88,156.52 | 66.88,156.52 66.88,145.11 | 66.88,145.11 Q9.E 59.48,144.17 R4.1 | R3.1 56.81,92.7 Q12.E 66.88,91.09 | R2.1 56.43,43.76 Q6.E 66.88,42.37 | 66.88,91.09 66.88,145.11 | 66.88,42.37 66.88,91.09 | Q13.3 23.31,16.59 13V_ZENER.C 30.86,16.59 C2.1 43.26,10.99 | Q15.3 55.99,151.66 58.73,154.4 61.07,154.4 Q16.2 64.79,154.43 66.88,156.52 | 43.26,10.99 C4.1 | 66.88,42.37 66.88,37.84 70.49,34.23 70.49,31.64 69.19,30.34 69.19,14.13 69.29,14.03 69.29,13.44 70.89,11.84 70.89,6.44 68.79,4.34 48.39,4.34 46.19,6.54 46.19,8.54 43.73,10.99 | 43.73,10.99 43.26,10.99 | Q18.2 57.74,11.98 55.11,14.62 Q17.3 48.27,14.62 44.64,10.99 43.73,10.99
12V_PREP
  Bottom 1.2: U$19.2 15.31,4.36 20.81,9.86 20.81,12.6 22.22,14 23.07,14 Q13.2
A
  Bottom 2.5: U$12.1 159.27,135.24 U$11.2
B
  Bottom 2.5: U$11.1 168.81,140.24 U$12.2
BJT_M_SIGNAL1
  Bottom 1.2: JP1.2 47.9,180.08 R12.1
BJT_M_SIGNAL2
  Bottom 1.2: R19.1 45.6,36.51 JP5.2
BJT_S_SIGNAL1
  Bottom 1.2: R26.1 44.13,136.91 JP3.2
BJT_S_SIGNAL2
  Bottom 1.2: JP7.2 45.75,85.5 R33.1
BOOM_BARRIER  (via drill 0.9 pad 2)
  Top 1.2: v64.2,159 69.69,153.52 v69.69,150.54
  Bottom 1.2: R13.2 47.63,174.01 R14.2 47.78,173.98 D1.K 59.57,173.98 63.32,177.72 Q3.C 63.32,173.69 U$6.2 68.69,168.32 68.69,163.49 v64.2,159 63.1,159 61.08,156.99 | Q16.1 61.08,156.99 | 61.08,156.99 57.58,156.99 57.34,156.74 Q15.1 | v69.69,150.54 69.69,109.84 72.51,107.01 U$5.8
BOOM_BARRIER_GREEN  (via drill 0.9 pad 2)
  Top 1.2: v74.29,146.65 74.19,146.75 v64.38,146.75
  Bottom 1.2: v64.38,146.75 61.1,150.03 Q16.3 | v74.29,146.65 79.08,141.86 U$5.9
BOOM_BARRIER_RED  (via drill 0.9 pad 2)
  Top 1.2: v63.05,162.73 63.05,162.81 64.68,162.81 71.92,155.57 v72.12,155.77
  Bottom 1.2: U$5.7 80.56,107.01 82.79,109.24 82.79,145.1 v72.12,155.77 | v63.05,162.73 53.58,162.73 48.89,158.04 48.89,155.64 50.32,154.2 Q15.2
C
  Bottom 2.5: U$14.1 159.77,66.82 U$13.2
D
  Bottom 2.5: U$13.1 159.77,61.74 U$14.2
E
  Bottom 2.5: U$27.1 159.61,116.04 U$26.2
F
  Bottom 2.5: U$26.1 168.87,121.14 U$27.2
G
  Bottom 2.5: U$29.1 159.87,98.14 U$28.2
GND
  pour Bottom: 0.35,205.33 32.25,205.33 32.25,22.96 0.35,22.96
GND1
  pour Bottom: 0.76,20.48 34.01,20.48 34.01,205.36 88.89,205.36 88.89,-0.37 0.76,-0.37
H
  Bottom 2.5: U$29.2 159.87,103.22 U$28.1
I
  Bottom 2.5: U$30.2 168.71,79.56 U$31.1
J
  Bottom 2.5: U$31.2 168.71,84.64 U$30.1
L_COM_1
  Bottom 2.5: 148.49,192.54 148.49,195.04 145.09,198.44 D6.A | U$25.2 148.41,192.46 148.49,192.54 | H.2 169.28,181.16 E.2 156.57,181.16 148.49,189.24 148.49,192.54
L_COM_2
  Bottom 2.5: D.2 169.29,41.87 A.2 158.52,41.87 134.19,17.54 134.19,9.54 | 134.19,9.54 134.19,4.69 U$24.2 | D5.A 134.19,9.54
L_NC_1
  Bottom 2.5: E.1 169.28,186.24 H.3
L_NC_2
  Bottom 2.5: A.1 169.29,46.95 D.3
L_NO_1
  Bottom 2.5: E.3 169.28,176.08 H.1
L_NO_2
  Bottom 2.5: A.3 169.29,36.79 D.1
LANE_OPERATION  (via drill 0.9 pad 2)
  Top 1.2: v67.04,32.6 67.04,32.73 72.99,38.68 v73,38.68
  Bottom 1.2: Q17.1 53.19,7.44 53.89,6.74 67.19,6.74 68.49,8.04 68.49,10.84 66.89,12.44 66.89,13.04 66.79,13.14 | 66.79,13.14 65.4,14.52 Q18.1 | 66.79,13.14 66.79,24.02 U$7.2 63.19,29.24 61.24,31.18 | Q6.C 62.35,32.29 | 62.35,32.29 61.24,31.18 | 61.24,31.18 57.9,27.83 D2.K 45.48,27.83 R21.2 R20.2 | v67.04,32.6 62.66,32.6 62.35,32.29 | v73,38.68 76.54,42.21 U$5.2
LANE_OPERATION_GREEN  (via drill 0.9 pad 2)
  Top 1.2: v65.79,9.44 75.49,9.44 v75.59,9.54
  Bottom 1.2: v75.59,9.54 79.08,13.03 79.08,28.64 84.49,34.05 84.49,101.24 81.25,104.47 U$5.5 | Q18.3 63.98,9.44 v65.79,9.44
LANE_OPERATION_RED  (via drill 0.9 pad 2)
  Top 1.2: v47.89,10.74 47.89,14.74 50.99,17.84 73.69,17.84 v74.76,18.91
  Bottom 1.2: v47.89,10.74 47.99,10.84 49.69,10.84 50.93,12.08 Q17.2 | U$5.3 79.64,101.93 81.86,99.71 81.86,36.02 74.76,28.91 v74.76,18.91
MANUAL_M_SIGNAL1
  Bottom 1.2: JP2.2 40.02,184.17 JP1.3
MANUAL_M_SIGNAL2
  Bottom 1.2: JP6.2 39.01,39.14 JP5.3
MANUAL_S_SIGNAL1
  Bottom 1.2: JP4.2 40.11,139.51 JP3.3
MANUAL_S_SIGNAL2
  Bottom 1.2: JP8.2 39.15,88.13 JP7.3
N$1
  Bottom 1.2: Q14.1 20.59,197.5 13V_ZENER1.A 20.59,193.63 R6.2
N$2
  Bottom 1.2: R12.2 61.02,180.31 Q3.B
N$3
  Bottom 1.2: Q13.1 27.51,7.31 13V_ZENER.A 33.52,4.2 R5.2
N$8
  Bottom 1.2: JP2.1 47.74,186.79 R1.2
N$11
  Bottom 1.2: JP4.1 42.83,144.17 R4.2
N$12
  Bottom 1.2: R13.1 43.53,163.43 LED8.A
N$14
  Bottom 1.2: R11.2 28.49,171.51 Q2.1
N$16
  Bottom 1.2: Q6.B 53.46,36.27 R19.2
N$18
  Bottom 1.2: R20.1 41.9,16.14 LED9.A
N$19
  Bottom 1.2: R18.2 29.04,34.99 Q5.1
N$23
  Bottom 1.2: R26.2 60.49,139.36 Q9.B
N$25
  Bottom 1.2: R27.1 41.06,118.09 LED10.A
N$26
  Bottom 1.2: R25.2 28.79,136.76 Q8.1
N$28
  Bottom 1.2: JP6.1 45.42,43.65 R2.2
N$30
  Bottom 1.2: R33.2 60.15,85.58 Q12.B
N$32
  Bottom 1.2: R34.1 41.48,64.95 LED11.A
N$33
  Bottom 1.2: R32.2 28.68,83.91 Q11.1
N$34
  Bottom 1.2: JP8.1 45.58,92.68 R3.2
N_COM_1
  Bottom 2.5: D6.C 127.19,198.44 124.69,195.94 124.69,192.34 124.69,188.04 153.04,159.68 F.2 169.1,159.68 G.2
  Bottom 2.56: 124.69,192.34 130.92,192.34 U$25.1
N_COM_2
  Bottom 2.5: D5.C 151.69,9.54 | U$24.1 153.2,3.91 | C.2 169.29,20.97 B.2 156.62,20.97 153.2,17.55 153.2,8.02
  Bottom 2.56: 151.69,9.54 153.2,8.02 153.2,3.91
N_NC_1
  Bottom 2.5: F.1 169.1,164.76 G.3
N_NC_2
  Bottom 2.5: B.1 169.29,26.05 C.3
N_NO_1
  Bottom 2.5: F.3 169.1,154.6 G.1
N_NO_2
  Bottom 2.5: B.3 169.29,15.89 C.1
OPTO_M_SIGNAL1
  Bottom 1.2: JP1.1 38.48,173.18 Q2.4
OPTO_M_SIGNAL2
  Bottom 1.2: JP5.1 38.91,31.34 Q5.4
OPTO_S_SIGNAL1
  Bottom 1.2: JP3.1 36.41,130.73 Q8.4
OPTO_S_SIGNAL2
  Bottom 1.2: JP7.1 39.07,80.47 Q11.4
OVERHEAD_TRAFFIC_LIGHT  (via drill 0.9 pad 2)
  Top 1.2: v73.47,80.75 72.87,80.15 63.99,80.15 v63.91,80.23
  Bottom 1.2: R34.2 41.61,76.45 R35.2 50.35,76.45 D4.K 57.67,76.42 58.18,76.94 | Q12.C 62.65,81.4 61.47,80.23 | 61.47,80.23 58.18,76.94 | v63.91,80.23 61.47,80.23 | 58.18,76.94 59.51,75.62 U$10.2 | v73.47,80.75 73.57,80.85 73.57,100.32 75.19,101.93 U$5.4
P_TRIGGER_M_RELAY1
  Bottom 1.2: Q2.2 25.78,168.62 24.34,170.05 BOOM.2 21.95,169.9 Q1.2 14.42,169.9 13.53,170.79 13.53,174.21 12.59,175.15 11.43,175.15 10.12,176.46 R10.1
P_TRIGGER_M_RELAY2
  Bottom 1.2: Q5.2 29.02,26.52 25.77,26.52 24.43,27.86 SIREN.2 22.15,27.74 19.67,27.74 18.76,28.65 Q4.2 14.34,28.65 13.34,29.65 13.34,32.33 9.4,36.27 R17.1
P_TRIGGER_SSR_RELAY1
  Bottom 1.2: Q8.2 28.65,127.98 27.8,127.98 26.85,128.93 23.15,128.93 OVERHEAD.2 20.59,129.11 20.08,129.62 Q7.2 16.16,129.62 14.27,131.51 14.27,133.47 R24.1
P_TRIGGER_SSR_RELAY2
  Bottom 1.2: Q11.2 28.64,75.12 25.81,75.12 24.86,76.08 21.81,76.08 LANE.2 21.27,76.31 19.06,76.31 18.15,77.21 Q10.2 16.08,77.21 13.19,80.1 13.19,81.11 R31.1
SIREN  (via drill 0.9 pad 2)
  Top 1.2: v71.59,104.46 71.52,104.39 v62.11,104.39
  Bottom 1.2: R27.2 R28.2 49.68,129.1 D3.K 50.19,129.62 59.79,129.62 | Q9.C 62.71,131.09 U$9.2 59.79,129.62 | v62.11,104.39 59.79,106.71 59.79,129.62 | U$5.6 71.6,104.47 v71.59,104.46
TRIGGER_M_RELAY1
  Bottom 1.2: Q1.1 U$1.2 10.39,161.29 R15.2
TRIGGER_M_RELAY2
  Bottom 1.2: Q4.1 16.74,25.76 U$2.2 7.07,25.76 3.67,29.15 3.66,39.82 4.27,40.44 R7.2
TRIGGER_SSR_RELAY1
  Bottom 1.2: Q7.1 17.87,126.76 U$3.2 10.21,120.05 R9.2
TRIGGER_SSR_RELAY2
  Bottom 1.2: Q10.1 16.06,73.96 U$4.2 10.29,67.77 R8.2

### Text on the board
tDocu: MADE IN BANGLADESH | C:/Users/User/Desktop/A.bmp